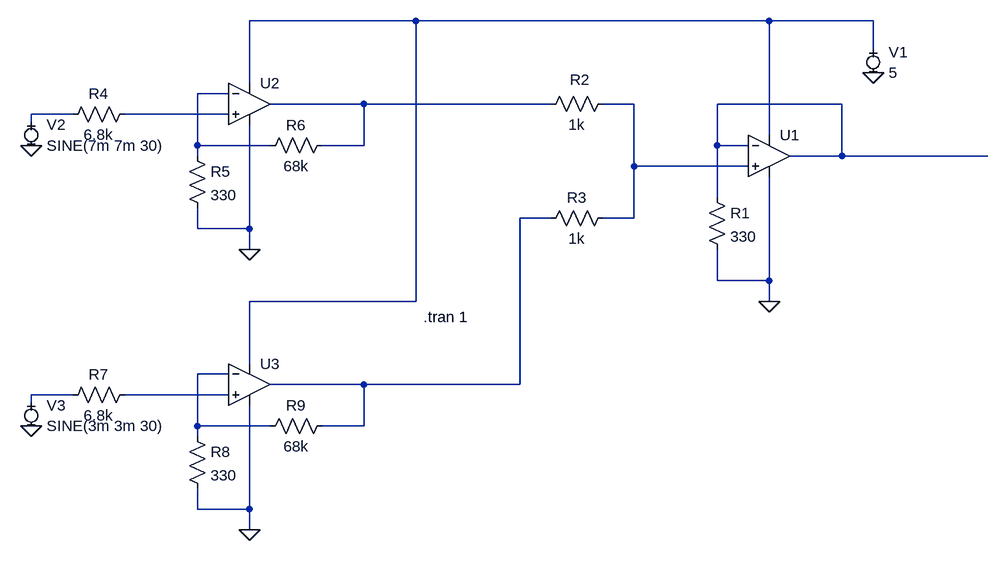
[diagram p0: schematic termocouple-op-amp.asc]
termocouple-op-amp.asc, the LTspice schematic file:
Version 4
SHEET 1 880 724
WIRE -336 -80 -592 -80
WIRE 208 -80 -336 -80
WIRE 368 -80 208 -80
WIRE 368 -32 368 -80
WIRE -592 16 -592 -80
WIRE -624 32 -672 32
WIRE -416 48 -560 48
WIRE -128 48 -416 48
WIRE 0 48 -48 48
WIRE 320 48 128 48
WIRE -864 64 -928 64
WIRE -624 64 -784 64
WIRE -928 80 -928 64
WIRE 208 96 208 -80
WIRE -672 112 -672 32
WIRE -560 112 -672 112
WIRE -416 112 -416 48
WIRE -416 112 -480 112
WIRE 128 112 128 48
WIRE 176 112 128 112
WIRE -672 128 -672 112
WIRE 320 128 320 48
WIRE 320 128 240 128
WIRE 544 128 320 128
WIRE 0 144 0 48
WIRE 176 144 0 144
WIRE 128 192 128 112
WIRE -128 224 -176 224
WIRE 0 224 0 144
WIRE 0 224 -48 224
WIRE -672 240 -672 208
WIRE -592 240 -592 80
WIRE -592 240 -672 240
WIRE -592 272 -592 240
WIRE 128 320 128 272
WIRE 208 320 208 160
WIRE 208 320 128 320
WIRE -336 352 -336 -80
WIRE -336 352 -592 352
WIRE 208 352 208 320
WIRE -592 448 -592 352
WIRE -624 464 -672 464
WIRE -416 480 -560 480
WIRE -176 480 -176 224
WIRE -176 480 -416 480
WIRE -864 496 -928 496
WIRE -624 496 -784 496
WIRE -928 512 -928 496
WIRE -672 544 -672 464
WIRE -560 544 -672 544
WIRE -416 544 -416 480
WIRE -416 544 -480 544
WIRE -672 560 -672 544
WIRE -672 672 -672 640
WIRE -592 672 -592 512
WIRE -592 672 -672 672
WIRE -592 704 -592 672
FLAG 208 352 0
FLAG 368 0 0
FLAG -592 272 0
FLAG -928 112 0
FLAG -592 704 0
FLAG -928 544 0
SYMBOL Opamps\\UniversalOpamp 208 128 R0
SYMATTR InstName U1
SYMBOL MiniSyms4\\voltage- 368 -16 R0
WINDOW 123 0 0 Left 2
WINDOW 39 0 0 Left 2
SYMATTR InstName V1
SYMATTR Value 5
SYMBOL res 112 176 R0
SYMATTR InstName R1
SYMATTR Value 330
SYMBOL res -32 32 R90
WINDOW 0 -6 51 VBottom 2
WINDOW 3 32 56 VTop 2
SYMATTR InstName R2
SYMATTR Value 1k
SYMBOL res -32 208 R90
WINDOW 0 0 56 VBottom 2
WINDOW 3 32 56 VTop 2
SYMATTR InstName R3
SYMATTR Value 1k
SYMBOL Opamps\\UniversalOpamp -592 48 R0
SYMATTR InstName U2
SYMBOL res -768 48 R90
WINDOW 0 0 56 VBottom 2
WINDOW 3 32 56 VTop 2
SYMATTR InstName R4
SYMATTR Value 6.8k
SYMBOL res -688 112 R0
SYMATTR InstName R5
SYMATTR Value 330
SYMBOL res -464 96 R90
WINDOW 0 0 56 VBottom 2
WINDOW 3 32 56 VTop 2
SYMATTR InstName R6
SYMATTR Value 68k
SYMBOL MiniSyms4\\voltage- -928 96 R0
WINDOW 123 0 0 Left 2
WINDOW 39 0 0 Left 2
SYMATTR InstName V2
SYMATTR Value SINE(7m 7m 30)
SYMBOL Opamps\\UniversalOpamp -592 480 R0
SYMATTR InstName U3
SYMBOL res -768 480 R90
WINDOW 0 0 56 VBottom 2
WINDOW 3 32 56 VTop 2
SYMATTR InstName R7
SYMATTR Value 6.8k
SYMBOL res -688 544 R0
SYMATTR InstName R8
SYMATTR Value 330
SYMBOL res -464 528 R90
WINDOW 0 0 56 VBottom 2
WINDOW 3 32 56 VTop 2
SYMATTR InstName R9
SYMATTR Value 68k
SYMBOL MiniSyms4\\voltage- -928 528 R0
WINDOW 123 0 0 Left 2
WINDOW 39 0 0 Left 2
SYMATTR InstName V3
SYMATTR Value SINE(3m 3m 30)
TEXT -324 376 Left 2 !.tran 1

The netlist it stands for:
* termocouple-op-amp.asc
XU1 N004 N005 N001 0 N005 level1 Avol=1Meg GBW=10Meg Vos=0 En=0 Enk=0 In=0 Ink=0 Rin=500Meg  ; pins In+ In- V+ V- OUT
V1 N001 0 5
R1 N005 0 330
R2 N004 N003 1k
R3 N004 N008 1k
XU2 N007 N002 N001 0 N003 level1 Avol=1Meg GBW=10Meg Vos=0 En=0 Enk=0 In=0 Ink=0 Rin=500Meg  ; pins In+ In- V+ V- OUT
R4 N007 N006 6.8k
R5 N002 0 330
R6 N003 N002 68k
V2 N006 0 SINE(7m 7m 30)
XU3 N011 N009 N001 0 N008 level1 Avol=1Meg GBW=10Meg Vos=0 En=0 Enk=0 In=0 Ink=0 Rin=500Meg  ; pins In+ In- V+ V- OUT
R7 N011 N010 6.8k
R8 N009 0 330
R9 N008 N009 68k
V3 N010 0 SINE(3m 3m 30)
.tran 1
.lib UniversalOpAmp1.lib
.backanno
.end